# Altium project SG_Proto_PDB.PrjPcb
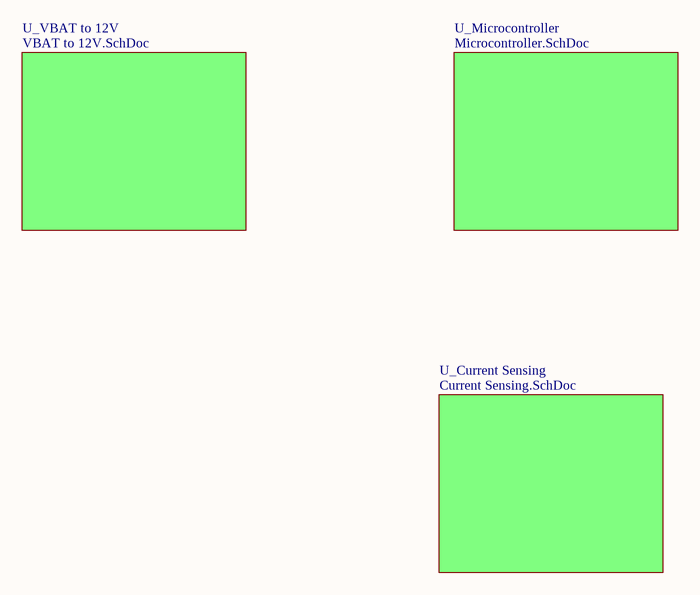
[diagram p0: Seaglider_Power_Board_Schematic.SchDoc]
4 sheets, 81 parts. Net scope: flat (ports and power ports of the same name join across sheets).
Board files: VBAT_to_12V.PcbDoc, Current_Sensor.PcbDoc, Microcontroller.PcbDoc
Sheets:
  Seaglider_Power_Board_Schematic.SchDoc
    U_VBAT to 12V = VBAT to 12V.SchDoc
    U_Microcontroller = Microcontroller.SchDoc
    U_Current Sensing = Current Sensing.SchDoc

## Sheet Seaglider_Power_Board_Schematic.SchDoc
size A; SheetNumber: 1; SheetTotal: 4

### Sub-sheets
U_Current Sensing = Current Sensing.SchDoc: no entries
U_Microcontroller = Microcontroller.SchDoc: no entries
U_VBAT to 12V = VBAT to 12V.SchDoc: no entries

## Sheet VBAT to 12V.SchDoc
size A; SheetNumber: 3; SheetTotal: 4
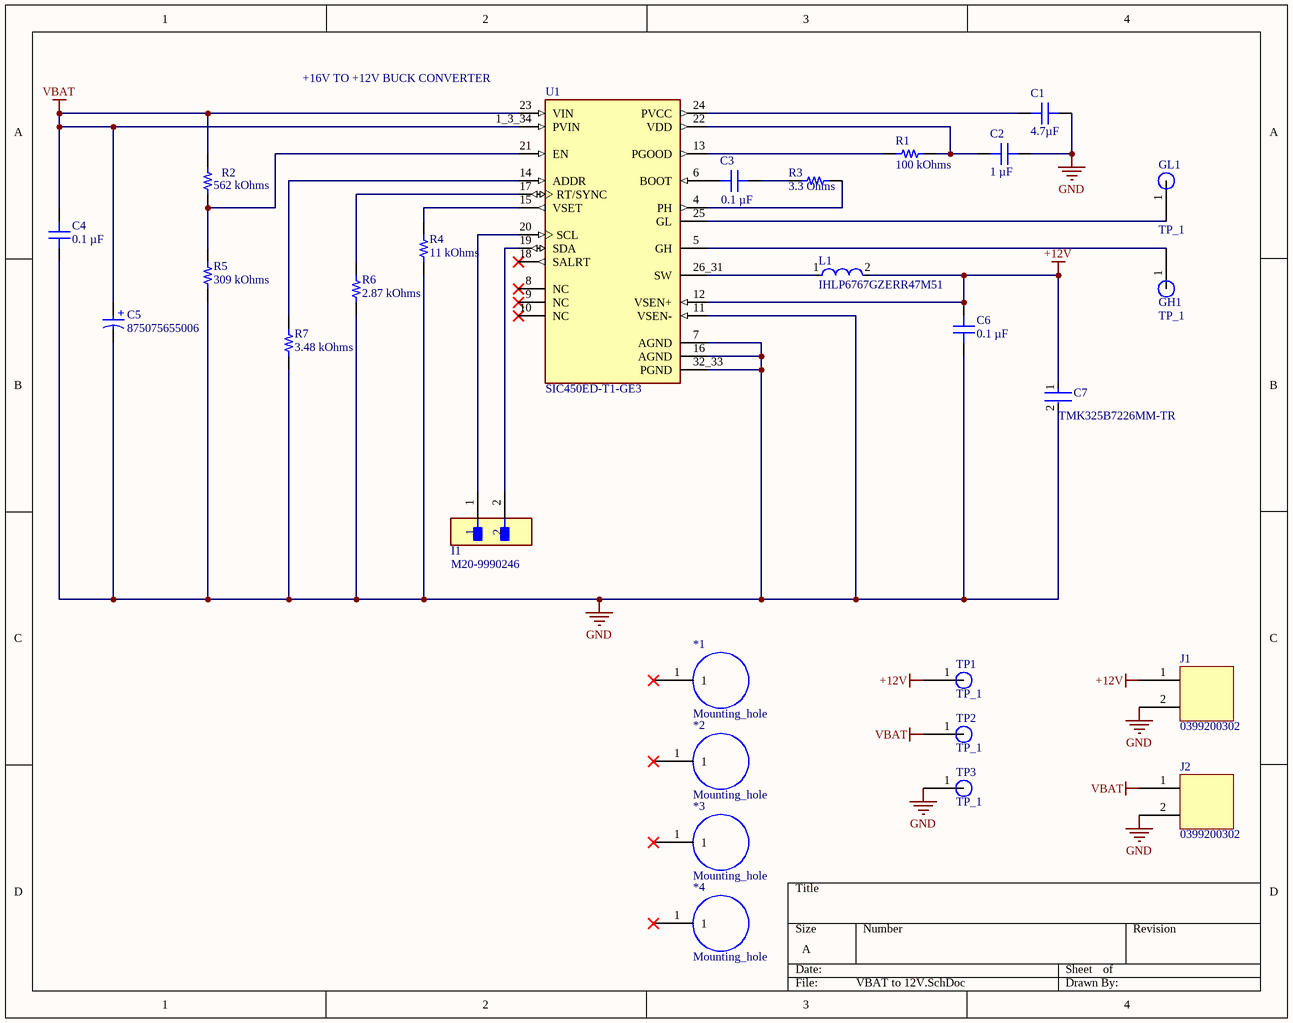
[diagram p1: VBAT to 12V.SchDoc]

### Parts
*1  Mounting_hole  [Mounting_Hole]
*2  Mounting_hole  [Mounting_Hole]
*3  Mounting_hole  [Mounting_Hole]
*4  Mounting_hole  [Mounting_Hole]
C1  4.7µF  [CAP 0603_1608]
C2  1 µF  [CAP 0603_1608]
C3  0.1 µF  [CAP 0402_1005]
C4  0.1 µF  [CAP 0402_1005]
C5  875075655006  [WCAP-PSLC_D8H11.7]
C6  0.1 µF  [CAP 0402_1005]
C7  TMK325B7226MM-TR  [FP-1210-L_3_2_0_3-W_2_5_0-MFG]
GH1  TP_1  [Test_point1]  (no BOM)
GL1  TP_1  [Test_point1]  (no BOM)
I1  M20-9990246  [FP-M20-9990246-MFG]
J1  0399200302  [0399200302]  (no BOM)
J2  0399200302  [0399200302]  (no BOM)
L1  IHLP6767GZERR47M51  [FP-IHLP-6767GZ-FP_3_825x1-MFG]
R1  100 kOhms  [RES 0402_1005]
R2  562 kOhms  [RES 0603_1608]
R3  3.3 Ohms  [RES 0402_1005]
R4  11 kOhms  [RES 0603_1608]
R5  309 kOhms  [RES 0603_1608]
R6  2.87 kOhms  [RES 0603_1608]
R7  3.48 kOhms  [RES 0603_1608]
TP1  TP_1  [Test_point1]  (no BOM)
TP2  TP_1  [Test_point1]  (no BOM)
TP3  TP_1  [Test_point1]  (no BOM)
U1  SIC450ED-T1-GE3  [VREG_SIC450ED-T1-GE3]

### Nets
+12V: C6.2 C7.1 J1.1 L1.2 TP1.1 U1.12(VSEN+)
GND: C1.1 C2.1 C4.1 C5.2(N) C6.1 C7.2 J1.2 J2.2 R4.1 R5.1 R6.1 R7.1 TP3.1 U1.7(AGND) U1.11(VSEN-) U1.16(AGND) U1.32_33(PGND)
VBAT: C4.2 C5.1(P) J2.1 R2.2 TP2.1 U1.1_3_34(PVIN) U1.23(VIN)
NetC1_2: C1.2 U1.24(PVCC)
NetC2_2: C2.2 R1.1 U1.22(VDD)
NetC3_1: C3.1 U1.6(BOOT)
NetC3_2: C3.2 R3.1
NetGH1_1: GH1.1 U1.5(GH)
NetGL1_1: GL1.1 U1.25(GL)
NetI1_1: I1.1 U1.20(SCL)
NetI1_2: I1.2 U1.19(SDA)
NetL1_1: L1.1 U1.26_31(SW)
NetR1_2: R1.2 U1.13(PGOOD)
NetR2_1: R2.1 R5.2 U1.21(EN)
NetR3_2: R3.2 U1.4(PH)
NetR4_2: R4.2 U1.15(VSET)
NetR6_2: R6.2 U1.17(RT/SYNC)
NetR7_2: R7.2 U1.14(ADDR)

Not connected (* = marked no-connect by the designer): *1 1*; *2 1*; *3 1*; *4 1*; U1 8(NC)* 9(NC)* 10(NC)* 18(SALRT)*

### Notes on the sheet
- +16V TO +12V BUCK CONVERTER
- (in symbol CMP-03913-90235614-1) +

### Library data of the parts
C1 = 06036D475KAT4A: CAP CER 4.7UF 6.3V X5R 0603; manufacturer: AVX Corporation; Tolerance: ±10%; Part Number: 06036D475KAT4A; Value: 4.7µF; Applications: General Purpose; Capacitance: 4.7µF; componentlink1description: Datasheet; componentlink1url: http://datasheets.avx.com/cx5r.pdf; componentlink2description: DigiKey Link; componentlink2url: http://digikey.com/product-detail/en/avx-corporation/06036D475KAT4A/478-10813-1-ND/7536337; Device Package: 0603 (1608 Metric); lastupdated: 2020-09-02 1:03:34 AM; Lifecycle Status: Active; Minimum Order: 1; Mounting Type: Surface Mount, MLCC; Operating Temperature: -55°C ~ 85°C; Package / Case: 0603 (1608 Metric); packaging: TapeAndReel; partid: 2929; Part Status: Active; price: 0.02; series: -; Size / Dimension: 0.063" L x 0.032" W (1.60mm x 0.81mm); Supplier 1: DigiKey; Supplier Part Number 1: 478-10813-1-ND; Temperature Coefficient: X5R; Thickness (Max): 0.037" (0.94mm); Voltage - Rated: 6.3V
C2 = C0603X105M9RACAUTO: CAP CER 1UF 6.3V X7R 0603; manufacturer: KEMET; Tolerance: ±20%; Part Number: C0603X105M9RACAUTO; Value: 1 µF; Applications: Automotive, Boardflex Sensitive; Capacitance: 1 µF; componentlink1description: Datasheet; componentlink1url: https://api.kemet.com/component-edge/download/datasheet/C0603X105M9RACAUTO.pdf; componentlink2description: DigiKey Link; componentlink2url: https://www.digikey.com/en/products/detail/kemet/C0603X105M9RACAUTO/8635848; Device Package: 0603 (1608 Metric); Features: Soft Termination; lastupdated: 2024-01-28 8:09:58 PM; Lifecycle Status: Active; Minimum Order: 1; Mounting Type: Surface Mount, MLCC; Operating Temperature: -55°C ~ 125°C; Package / Case: 0603 (1608 Metric); packaging: TapeAndReel; partid: 2401; Part Status: Active; price: 0.06; Ratings: AEC-Q200; series: SMD Auto X7R Flex; Size / Dimension: 0.063" L x 0.031" W (1.60mm x 0.80mm); Supplier 1: DigiKey; Supplier Part Number 1: 399-17721-1-ND; Temperature Coefficient: X7R; Thickness (Max): 0.037" (0.95mm); Voltage - Rated: 6.3V
C3 = CL05B104KP5VPNC: CAP CER 100NF 10V X7R 0402; manufacturer: Samsung Electro-Mechanics; Tolerance: ±10%; Part Number: CL05B104KP5VPNC; Value: 0.1 µF; Applications: Automotive; Capacitance: 0.1 µF; componentlink1description: Datasheet; componentlink1url: https://mm.digikey.com/Volume0/opasdata/d220001/medias/docus/5458/CL05B104KP5VPNC_Spec.pdf; componentlink2description: DigiKey Link; componentlink2url: https://www.digikey.com/en/products/detail/samsung-electro-mechanics/CL05B104KP5VPNC/20498482; Device Package: 0402 (1005 Metric); lastupdated: 2024-01-28 8:02:59 PM; Lifecycle Status: Active; Minimum Order: 1; Mounting Type: Surface Mount, MLCC; Operating Temperature: -55°C ~ 125°C; Package / Case: 0402 (1005 Metric); packaging: TapeAndReel; partid: 56690; price: 0.01; Ratings: AEC-Q200; series: CL; Size / Dimension: 0.039" L x 0.020" W (1.00mm x 0.50mm); Supplier 1: DigiKey; Supplier Part Number 1: 1276-CL05B104KP5VPNCCT-ND; Temperature Coefficient: X7R; Thickness (Max): 0.022" (0.55mm); Voltage - Rated: 10V
C4 C6 = GCM155R71E104KE02D: CAP CER 0.1UF 25V X7R 0402; manufacturer: Murata Electronics; Tolerance: ±10%; Part Number: GCM155R71E104KE02D; Value: 0.1 µF; Applications: Automotive; Capacitance: 0.1 µF; componentlink1description: Datasheet; componentlink1url: https://search.murata.co.jp/Ceramy/image/img/A01X/G101/ENG/GCM155R71E104KE02-01.pdf; componentlink2description: DigiKey Link; componentlink2url: https://www.digikey.com/en/products/detail/murata-electronics/GCM155R71E104KE02D/7363175; Device Package: 0402 (1005 Metric); Lifecycle Status: Active; Minimum Order: 1; Mounting Type: Surface Mount, MLCC; Operating Temperature: -55°C ~ 125°C; Package / Case: 0402 (1005 Metric); packaging: TapeAndReel; partid: 2051; Part Status: Active; price: 0.01; Ratings: AEC-Q200; series: GCM; Size / Dimension: 0.039" L x 0.020" W (1.00mm x 0.50mm); Supplier 1: DigiKey; Supplier Part Number 1: 490-16431-1-ND; Temperature Coefficient: X7R; Thickness (Max): 0.022" (0.55mm); Voltage - Rated: 25V
  C4: lastupdated: 2024-02-09 8:04:37 PM
  C6: lastupdated: 2024-01-28 8:04:19 PM
C5 = CMP-03913-90235614-1: 875075655006 Cap, 150Uf, 35V, Alu Elec Smd, Polymer Rohs Compliant: Yes; Leakage Current: 840µA; ESR (Equivalent Series Resistance): 25mΩ; Capacitance: 150µF; Ripple Current: 3.8A; Width: 8.3mm; Min Operating Temperature: -55°C; Voltage Rating: 35V; Diameter: 8mm; Length: 11.7mm; RoHS: Compliant; NexarPartId: 90235614; Max Operating Temperature: 105°C
C7 = CMP-14477-000122-1: CAP CER 22UF 25V X7R 1210; Tolerance: 20%; Length: 3.2mm; Packaging: Tape and Reel; REACH SVHC: No SVHC; Case Code (Imperial): 1210; Mount: Surface Mount; Depth: 2.5mm; Resistor Type: Ceramic; Thickness: 0.106inch; Lead Free: Lead Free; Construction: Flat; Min Operating Temperature: -55°C; Voltage: 25V; Voltage Rating: 25V; Capacitance: 22uF; Radiation Hardening: No; Halogen Free: Halogen Free; Max Operating Temperature: 125°C; Case/Package: 1210; Case Code (Metric): 3225; Height: 2.5mm; Width: 0.098inch; Series: M; Package Quantity: 500; RoHS Compliant: Yes; Dielectric: X7R; Termination: SMD/SMT; Number of Pins: 2; Voltage Rating (DC): 25V
GH1 GL1 TP1-TP3 = Test_point1
I1 = CMP-15831-000009-1: CONN HEADER VERT 2POS 2.54MM; Manufacturer: Harwin; Conn Gender: Male; Conn Orientation: Vertical; Number Of Contacts: 2; Current Rating: 3A; ComponentLink2URL: https://cdn.harwin.com/pdfs/M20-999.pdf; ComponentLink2Description: Datasheet; Package: M20-9990246; Temperature: -40°C to +105°C; Octopart: https://octopart.com/m20-9990246-harwin-2590635; Mouser Description: 2.54mm (0.1") Pitch SIL Vertical PC Tail Pin Header, 6.1mm mating pin height, tin, 2 contacts; Temperature Range High: +105°C; Device Class L1: Connectors; RoHS: TRUE; Automotive: No; Height: 8.99mm; Number Of Rows: 1; Contact Material: Tin,Nickel; Category: Conn; Pitch: 2.54mm; Lead Free: Yes; Digikey Description: CONN HEADER VERT 2POS 2.54MM; Manufacturer Part Number: M20-9990246; Temperature Range Low: -40°C; Device Class L3: unset; Device Class L2: Headers and Wire Housings
L1 = CMP-02424-000445-1: Commercial Inductors, High Temperature (155 °C) Series 0.47uH 65A 0.95mΩ 20%; Max DC Current: 63A; DC Resistance (DCR): 0.95mR; Saturation Current: 76A; Resistance: 950R; Self Resonant Frequency: 52.3MHz; Inductance: 470nH; Test Frequency: 100kHz; Shielding: Shielded; Max Operating Temperature: 155°C; Height: 7mm; Case/Package: 6767; Termination: SMD/SMT; Width: 17.15mm; Package Quantity: 200; Length: 0.675inch; Tolerance: 20%; Inductance Tolerance: 20%; Depth: 17.5mm; Radiation Hardening: No; Height - Seated (Max): 0.276inch; RMS Current (Irms): 63A; Mount: Surface Mount; Current Rating: 65A; Lead Free: Lead Free; Weight: 0.417996oz; Packaging: Tape and Reel; Min Operating Temperature: -55°C
R1 = RT0402FRE07100KL: RES SMD 100K OHM 1% 1/16W 0402; Manufacturer: Yageo; Power (Watts): 0.063W, 1/16W; Temperature Coefficient: ±50ppm/°C; Part Number: RT0402FRE07100KL; Value: 100 kOhms; ComponentLink1Description: Datasheet; ComponentLink1URL: https://www.yageo.com/upload/media/product/productsearch/datasheet/rchip/PYu-RT_1-to-0.01_RoHS_L_11.pdf; ComponentLink2Description: DigiKey Link; ComponentLink2URL: https://www.digikey.com/en/products/detail/yageo/RT0402FRE07100KL/1071698; Composition: Thin Film; Device Package: 0402 (1005 Metric); Height - Seated (Max): 0.014" (0.35mm); LastUpdated: 2024-01-28 8:28:38 PM; Lifecycle Status: Active; Minimum Order: 1; Number of Terminations: 2; Operating Temperature: -55°C ~ 155°C; Package / Case: 0402 (1005 Metric); Packaging: TapeAndReel; PartId: 3190; Part Status: Active; Price: 0.01; Resistance: 100 kOhms; Series: RT; Size / Dimension: 0.039" L x 0.020" W (1.00mm x 0.50mm); Supplier 1: DigiKey; Supplier Part Number 1: YAG2307CT-ND; Supplier Device Package: 0402; Tolerance: ±1%
R2 = RK73H1JTTD5623F: RES 562K OHM 1% 1/10W 0603; Manufacturer: KOA Speer Electronics, Inc.; Power (Watts): 0.1W, 1/10W; Temperature Coefficient: ±100ppm/°C; Part Number: RK73H1JTTD5623F; Value: 562 kOhms; ComponentLink1Description: Datasheet; ComponentLink1URL: http://www.koaspeer.com/catimages/Products/RK73H/RK73H.pdf; ComponentLink2Description: DigiKey Link; ComponentLink2URL: https://www.digikey.com/en/products/detail/koa-speer-electronics-inc/RK73H1JTTD5623F/9845175; Composition: Thick Film; Device Package: 0603 (1608 Metric); Features: Automotive AEC-Q200, Moisture Resistant; Height - Seated (Max): 0.022" (0.55mm); LastUpdated: 2024-01-28 8:39:45 PM; Lifecycle Status: Active; Minimum Order: 1; Number of Terminations: 2; Operating Temperature: -55°C ~ 155°C; Package / Case: 0603 (1608 Metric); Packaging: CutTape; PartId: 8595; Part Status: Active; Price: 0.01; Ratings: AEC-Q200; Resistance: 562 kOhms; Series: RK73H; Size / Dimension: 0.063" L x 0.031" W (1.60mm x 0.80mm); Supplier 1: DigiKey; Supplier Part Number 1: 2019-RK73H1JTTD5623FCT-ND; Supplier Device Package: 0603; Tolerance: ±1%
R3 = ERJ-2GEJ3R3X: RES SMD 3.3 OHM 5% 1/10W 0402; Manufacturer: Panasonic Electronic Components; Power (Watts): 0.1W, 1/10W; Temperature Coefficient: -100/ +600ppm/°C; Part Number: ERJ-2GEJ3R3X; Value: 3.3 Ohms; ComponentLink1Description: Datasheet; ComponentLink1URL: https://b2b-api.panasonic.eu/file_stream/pids/fileversion/1242; ComponentLink2Description: DigiKey Link; ComponentLink2URL: https://www.digikey.com/en/products/detail/panasonic-electronic-components/ERJ-2GEJ3R3X/282082; Composition: Thick Film; Device Package: 0402 (1005 Metric); Features: Automotive AEC-Q200; Height - Seated (Max): 0.016" (0.40mm); LastUpdated: 2024-01-28 8:28:37 PM; Lifecycle Status: Active; Minimum Order: 1; Number of Terminations: 2; Operating Temperature: -55°C ~ 155°C; Package / Case: 0402 (1005 Metric); Packaging: CutTape; PartId: 3568; Part Status: Active; Price: 0.01; Ratings: AEC-Q200; Resistance: 3.3 Ohms; Series: ERJ-2G; Size / Dimension: 0.039" L x 0.020" W (1.00mm x 0.50mm); Supplier 1: DigiKey; Supplier Part Number 1: P3.3JCT-ND; Supplier Device Package: 0402; Tolerance: ±5%
R4 = TNPW060311K0BYEN: RES 11K OHM 0.1% 1/10W 0603; Manufacturer: Vishay Dale; Power (Watts): 0.1W, 1/10W; Temperature Coefficient: ±10ppm/°C; Part Number: TNPW060311K0BYEN; Value: 11 kOhms; ComponentLink1Description: Datasheet; ComponentLink1URL: http://www.vishay.com/docs/28758/tnpw_e3.pdf; ComponentLink2Description: DigiKey Link; ComponentLink2URL: https://www.digikey.com/en/products/detail/vishay-dale/TNPW060311K0BYEN/8636632; Composition: Thin Film; Device Package: 0603 (1608 Metric); Features: Anti-Sulfur, Automotive AEC-Q200, Moisture Resistant; Height - Seated (Max): 0.022" (0.55mm); LastUpdated: 2024-01-28 8:39:55 PM; Lifecycle Status: Active; Minimum Order: 1; Number of Terminations: 2; Operating Temperature: -55°C ~ 155°C; Package / Case: 0603 (1608 Metric); Packaging: TapeAndReel; PartId: 6393; Part Status: Active; Price: 0.25; Ratings: AEC-Q200; Resistance: 11 kOhms; Series: TNPW e3; Size / Dimension: 0.061" L x 0.033" W (1.55mm x 0.85mm); Supplier 1: DigiKey; Supplier Part Number 1: 541-9816-1-ND; Supplier Device Package: 0603; Tolerance: ±0.1%
R5 = RG1608P-3093-B-T5: RES SMD 309K OHM 0.1% 1/10W 0603; Manufacturer: Susumu; Power (Watts): 0.1W, 1/10W; Temperature Coefficient: ±25ppm/°C; Part Number: RG1608P-3093-B-T5; Value: 309 kOhms; ComponentLink1Description: Datasheet; ComponentLink1URL: //media.digikey.com/pdf/Data%20Sheets/Susumu%20PDFs/RG_RM_RGH_Oct2012.pdf; ComponentLink2Description: DigiKey Link; ComponentLink2URL: https://www.digikey.com/en/products/detail/susumu/RG1608P-3093-B-T5/1240553; Composition: Thin Film; Device Package: 0603 (1608 Metric); Features: Anti-Sulfur, Automotive AEC-Q200; Height - Seated (Max): 0.020" (0.50mm); LastUpdated: 2024-01-28 8:39:51 PM; Lifecycle Status: Active; Minimum Order: 1; Number of Terminations: 2; Operating Temperature: -55°C ~ 155°C; Package / Case: 0603 (1608 Metric); Packaging: TapeAndReel; PartId: 7313; Part Status: Active; Price: 0.05; Ratings: AEC-Q200; Resistance: 309 kOhms; Series: RG; Size / Dimension: 0.063" L x 0.031" W (1.60mm x 0.80mm); Supplier 1: DigiKey; Supplier Part Number 1: RG16P309KBCT-ND; Supplier Device Package: 0603; Tolerance: ±0.1%
R6 = RC0603FR-072K87L: RES 2.87K OHM 1% 1/10W 0603; Manufacturer: Yageo; Power (Watts): 0.1W, 1/10W; Temperature Coefficient: ±100ppm/°C; Part Number: RC0603FR-072K87L; Value: 2.87 kOhms; ComponentLink1Description: Datasheet; ComponentLink1URL: https://www.yageo.com/upload/media/product/productsearch/datasheet/rchip/PYu-RC_Group_51_RoHS_L_10.pdf; ComponentLink2Description: DigiKey Link; ComponentLink2URL: https://www.digikey.com/en/products/detail/yageo/RC0603FR-072K87L/727036; Composition: Thick Film; Device Package: 0603 (1608 Metric); Features: Moisture Resistant; Height - Seated (Max): 0.022" (0.55mm); LastUpdated: 2024-01-28 8:39:50 PM; Lifecycle Status: Active; Minimum Order: 1; Number of Terminations: 2; Operating Temperature: -55°C ~ 155°C; Package / Case: 0603 (1608 Metric); Packaging: CutTape; PartId: 7498; Part Status: Active; Price: 0.01; Resistance: 2.87 kOhms; Series: RC_L; Size / Dimension: 0.063" L x 0.031" W (1.60mm x 0.80mm); Supplier 1: DigiKey; Supplier Part Number 1: 311-2.87KHRCT-ND; Supplier Device Package: 0603; Tolerance: ±1%
R7 = RNCP0603FTD3K48: RES 3.48K OHM 1% 1/8W 0603; Manufacturer: Stackpole Electronics Inc; Power (Watts): 0.125W, 1/8W; Temperature Coefficient: ±100ppm/°C; Part Number: RNCP0603FTD3K48; Value: 3.48 kOhms; ComponentLink1Description: Datasheet; ComponentLink1URL: https://www.seielect.com/catalog/sei-rncp.pdf; ComponentLink2Description: DigiKey Link; ComponentLink2URL: https://www.digikey.com/en/products/detail/stackpole-electronics-inc/RNCP0603FTD3K48/2240122; Composition: Thin Film; Device Package: 0603 (1608 Metric); Features: Anti-Sulfur; Height - Seated (Max): 0.020" (0.50mm); LastUpdated: 2024-01-28 8:39:52 PM; Lifecycle Status: Active; Minimum Order: 1; Number of Terminations: 2; Operating Temperature: -55°C ~ 155°C; Package / Case: 0603 (1608 Metric); Packaging: TapeAndReel; PartId: 6983; Part Status: Active; Price: 0.01; Resistance: 3.48 kOhms; Series: RNCP; Size / Dimension: 0.059" L x 0.031" W (1.50mm x 0.80mm); Supplier 1: DigiKey; Supplier Part Number 1: RNCP0603FTD3K48CT-ND; Supplier Device Package: 0603; Tolerance: ±1%
U1 = CMP-351-000000-4: Buck Switching Regulator IC Positive Adjustable 0.3V 1 Output 40A 34-PowerWFQFN; MF: Vishay Siliconix; Design Item ID: SIC450ED-T1-GE3; Source: SIC450ED-T1-GE3.SchLib; MP: SIC450ED-T1-GE3; Availability: In Stock; Purchase-URL: https://pricing.snapeda.com/search/part/SIC450ED-T1-GE3/?ref=eda; Package: PowerWFQFN-34 Vishay Siliconix; Component Type: Standard; Pin Count: 25; Check_prices: https://www.snapeda.com/parts/SIC450ED-T1-GE3/Vishay+Siliconix/view-part/?ref=eda; SnapEDA_Link: https://www.snapeda.com/parts/SIC450ED-T1-GE3/Vishay+Siliconix/view-part/?ref=snap; Value: *; Price: None

## Sheet Microcontroller.SchDoc
size 558 x 431 mm; SheetNumber: 2; SheetTotal: 4
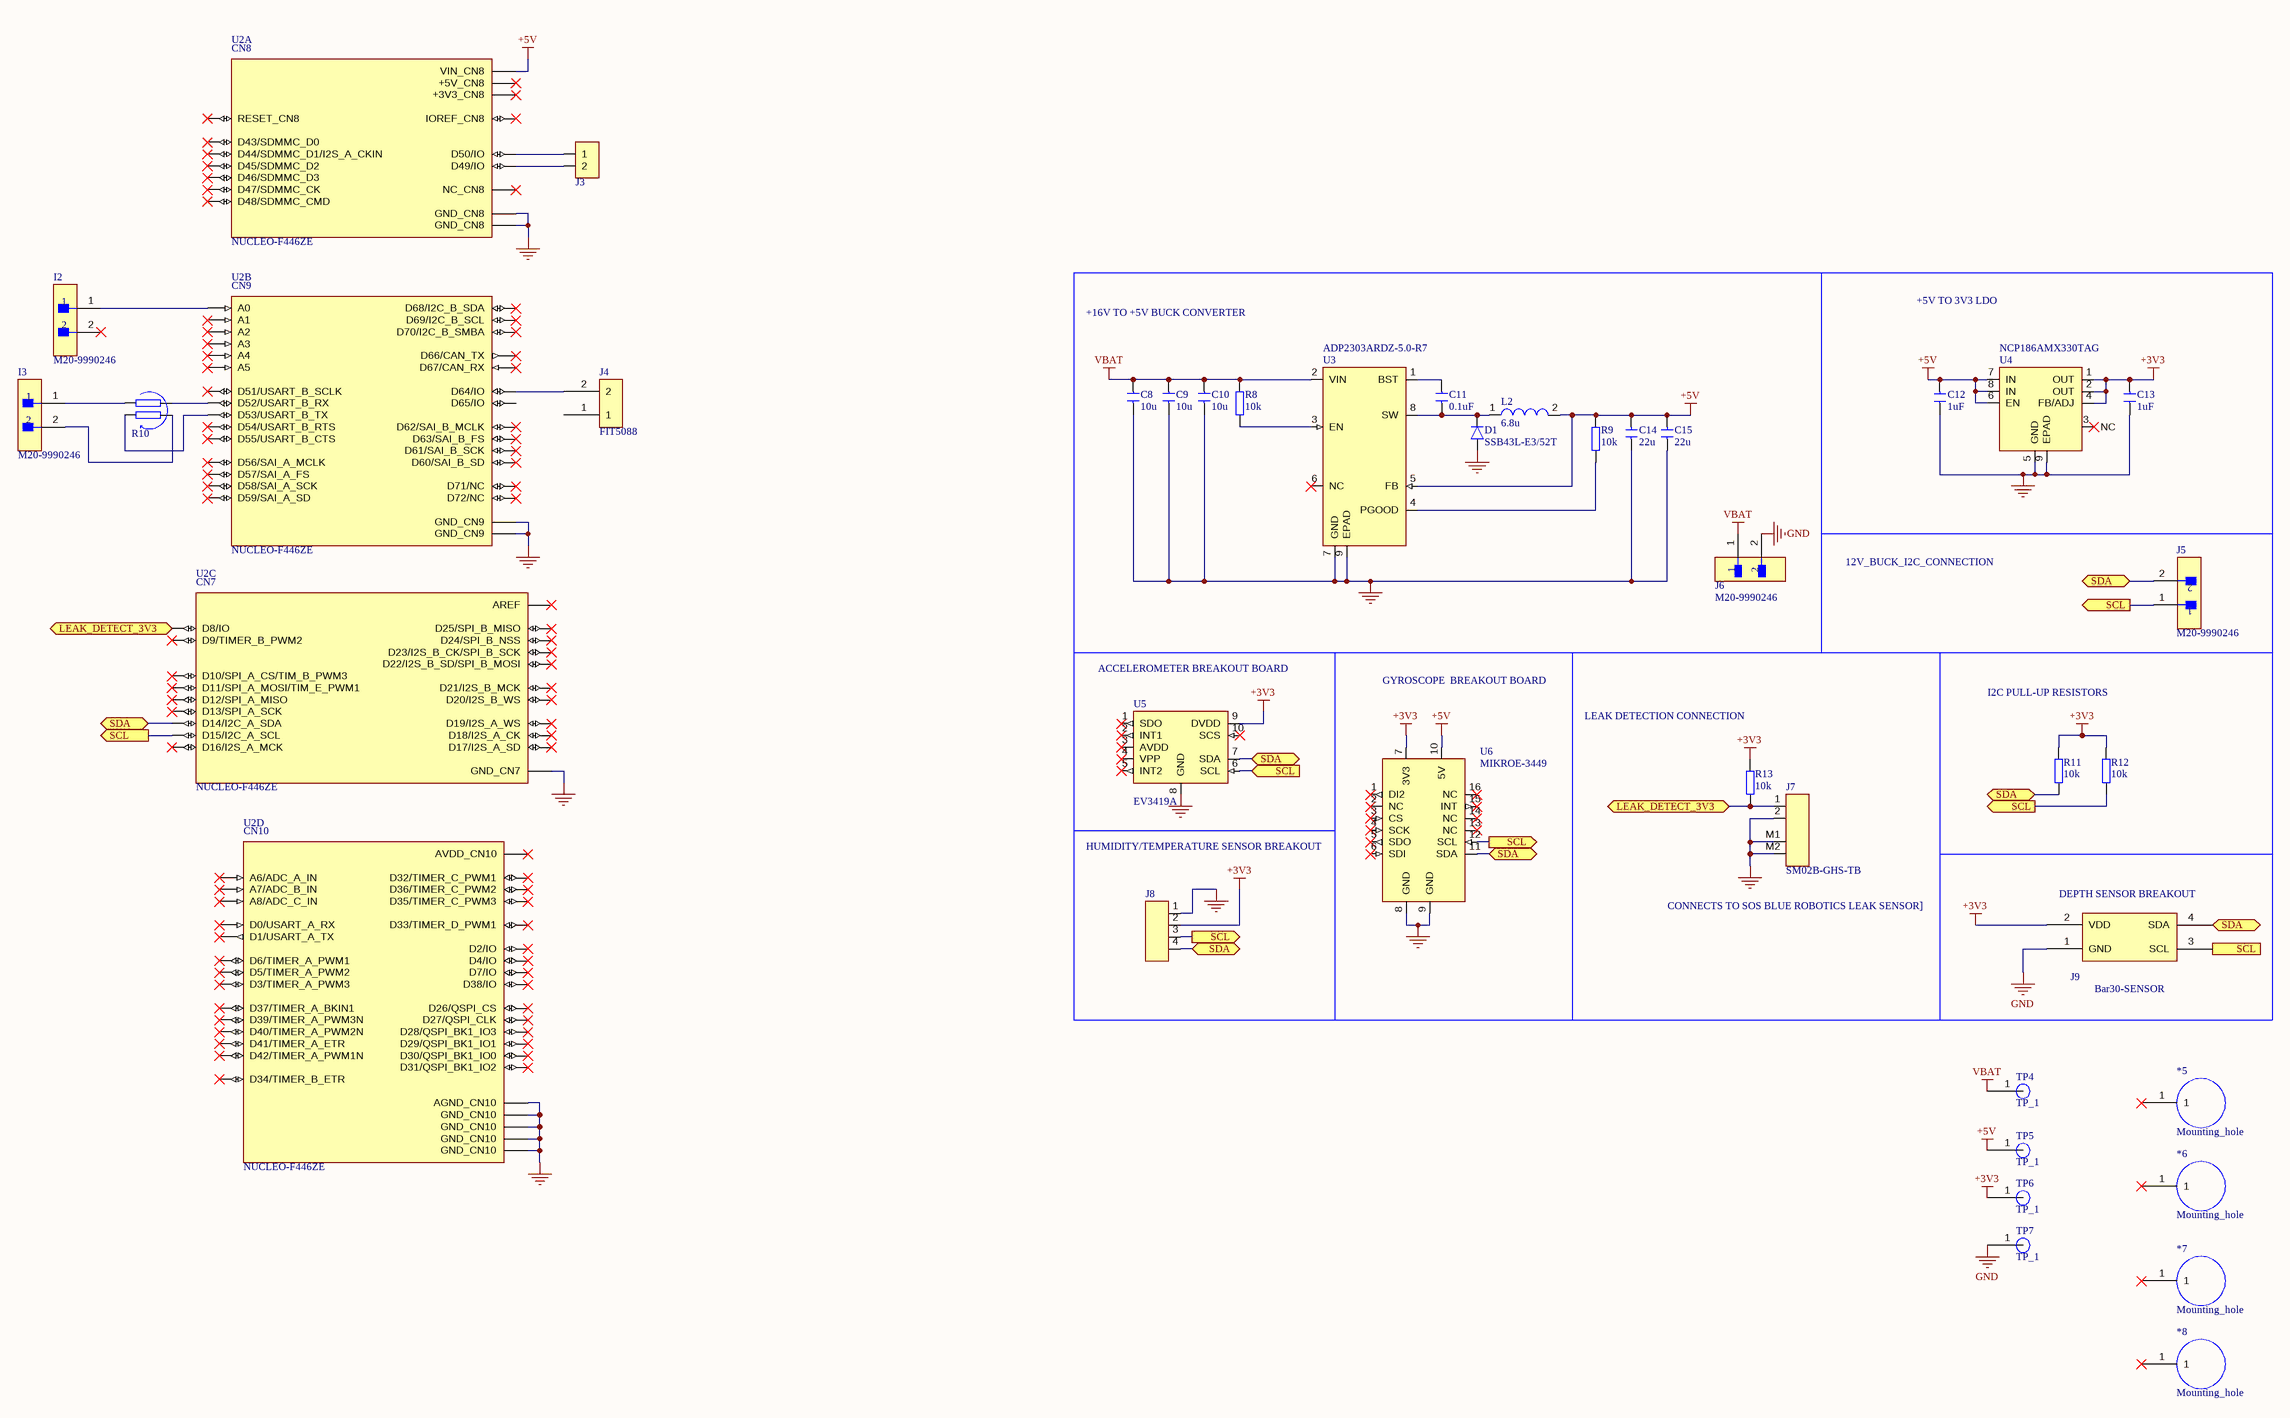
[diagram p2: Microcontroller.SchDoc]

### Parts
*5  Mounting_hole  [Mounting_Hole]
*6  Mounting_hole  [Mounting_Hole]
*7  Mounting_hole  [Mounting_Hole]
*8  Mounting_hole  [Mounting_Hole]
C8  10u  [1206 Capacitor]
C9  10u  [1206 Capacitor]
C10  10u  [1206 Capacitor]
C11  0.1uF  [0603 Capacitor]
C12  1uF  [0603 Capacitor]
C13  1uF  [0603 Capacitor]
C14  22u  [0805 Capacitor]
C15  22u  [0805 Capacitor]
D1  SSB43L-E3/52T  [DO-214AA]
I2  M20-9990246  [FP-M20-9990246-MFG]
I3  M20-9990246  [FP-M20-9990246-MFG]
J3  PREC002SAAN-RC  [Header 2.54mm]  (value not drawn)
J4  FIT5088  [FIT0588]
J5  M20-9990246  [FP-M20-9990246-MFG]
J6  M20-9990246  [FP-M20-9990246-MFG]
J7  SM02B-GHS-TB  [SM02B-GHS-TB]
J8  PPTC041LFBN-RC  [HDR 4POS 2.54mm]  (value not drawn)
J9  Bar30-SENSOR  [Bar30 Depth Sensor]
L2  6.8u  [CLF10060NIT-6R8N-D 10.10mm x 10.00mm]
R8  10k  [0603 Resistor]
R9  10k  [0603 Resistor]
R10  Resistor Signal Switch  [Resistor Signal Switch-Footprint]  (value not drawn)
R11  10k  [0603 Resistor]
R12  10k  [0603 Resistor]
R13  10k  [0603 Resistor]
TP4  TP_1  [Test_point1]  (no BOM)
TP5  TP_1  [Test_point1]  (no BOM)
TP6  TP_1  [Test_point1]  (no BOM)
TP7  TP_1  [Test_point1]  (no BOM)
U2  NUCLEO-F446ZE  [MODULE_NUCLEO-F446ZE]  (parts A,B,C,D of 4)
U3  ADP2303ARDZ-5.0-R7  [SOIC-8-EP]
U4  NCP186AMX330TAG  [8-XFDFN Exposed Pad]
U5  EV3419A  [EV3419A]
U6  MIKROE-3449  [MIKROE-3449]

### Ports
LEAK_DETECT_3V3 (bidir, see Microcontroller[3E]), LEAK_DETECT_3V3 (bidir, see Microcontroller[9E]), SCL (in, see Microcontroller[1D], Microcontroller[2E], Microcontroller[4D], Microcontroller[5D], Microcontroller[9E]), SCL (out, see Microcontroller[1D], Microcontroller[2E], Microcontroller[4D], Microcontroller[5D], Microcontroller[5E]), SCL (out, see Microcontroller[1D], Microcontroller[2E], Microcontroller[4D], Microcontroller[5D], Microcontroller[5E], Microcontroller[9E]), SCL (out, see Microcontroller[1D], Microcontroller[2E], Microcontroller[4D], Microcontroller[5E], Microcontroller[9E]), SCL (out, see Microcontroller[1D], Microcontroller[2E], Microcontroller[5D], Microcontroller[5E], Microcontroller[9E]), SCL (out, see Microcontroller[2E], Microcontroller[4D], Microcontroller[5D], Microcontroller[5E], Microcontroller[9E]), SDA (bidir, see Microcontroller[1D], Microcontroller[2E], Microcontroller[4D], Microcontroller[5D], Microcontroller[5E]), SDA (bidir, see Microcontroller[1D], Microcontroller[2E], Microcontroller[4D], Microcontroller[5D], Microcontroller[5E], Microcontroller[9E]), SDA (bidir, see Microcontroller[1D], Microcontroller[2E], Microcontroller[4D], Microcontroller[5D], Microcontroller[9E]), SDA (bidir, see Microcontroller[1D], Microcontroller[2E], Microcontroller[4D], Microcontroller[5E], Microcontroller[9E]), SDA (bidir, see Microcontroller[1D], Microcontroller[2E], Microcontroller[5D], Microcontroller[5E], Microcontroller[9E]), SDA (bidir, see Microcontroller[2E], Microcontroller[4D], Microcontroller[5D], Microcontroller[5E], Microcontroller[9E])

### Nets
+3V3: C13.1 J8.2 J9.2(VDD) R11.2 R12.2 R13.2 TP6.1 U4.1(OUT) U4.2(OUT) U4.4(FB/ADJ) U5.9(DVDD) U6.7(3V3)
+5V: C12.1 C14.1 C15.1 L2.2 R9.1 TP5.1 U2.CN8_15(VIN_CN8) U3.5(FB) U4.6(EN) U4.7(IN) U4.8(IN) U6.10(5V)
GND: C8.1 C9.1 C10.1 C12.2 C13.2 C14.2 C15.2 D1.A J6.2 J7.2 J7.M1 J7.M2 J8.1 J9.1(GND) TP7.1 U2.CN7_8(GND_CN7) U2.CN8_11(GND_CN8) U2.CN8_13(GND_CN8) U2.CN9_12(GND_CN9) U2.CN9_23(GND_CN9) U2.CN10_3(AGND_CN10) U2.CN10_5(GND_CN10) U2.CN10_17(GND_CN10) U2.CN10_22(GND_CN10) U2.CN10_27(GND_CN10) U3.7(GND) U3.9(EPAD) U4.5(GND) U4.9(EPAD) U5.8(GND) U6.8(GND) U6.9(GND)
VBAT: C8.2 C9.2 C10.2 J6.1 R8.1 TP4.1 U3.2(VIN)
NetC11_1: C11.1 D1.C L2.1 U3.8(SW)
NetC11_2: C11.2 U3.1(BST)
NetI2_1: I2.1 U2.CN9_1(A0)
NetI3_1: I3.1 R10.4
NetI3_2: I3.2 R10.1
NetJ3_1: J3.1 U2.CN8_16(D50/IO)
NetJ3_2: J3.2 U2.CN8_14(D49/IO)
NetJ4_2: J4.2 U2.CN9_30(D64/IO)
NetJ5_1: J5.1 J8.3 J9.3(SCL) R12.1 U2.CN7_2(D15/I2C_A_SCL) U5.6(SCL) U6.12(SCL) ; port SCL
NetJ5_2: J5.2 J8.4 J9.4(SDA) R11.1 U2.CN7_4(D14/I2C_A_SDA) U5.7(SDA) U6.11(SDA) ; port SDA
NetJ7_1: J7.1 R13.1 U2.CN7_20(D8/IO) ; port LEAK_DETECT_3V3
NetR8_2: R8.2 U3.3(EN)
NetR9_2: R9.2 U3.4(PGOOD)
NetR10_2: R10.2 U2.CN9_6(D53/USART_B_TX)
NetR10_3: R10.3 U2.CN9_4(D52/USART_B_RX)

Not connected (* = marked no-connect by the designer): *5 1*; *6 1*; *7 1*; *8 1*; I2 2*; J4 1; U2 CN7_1(D16/I2S_A_MCK)* CN7_3(D17/I2S_A_SD)* CN7_5(D18/I2S_A_CK)* CN7_6(AREF)* CN7_7(D19/I2S_A_WS)* CN7_9(D20/I2S_B_WS)* CN7_10(D13/SPI_A_SCK)* CN7_11(D21/I2S_B_MCK)* CN7_12(D12/SPI_A_MISO)* CN7_13(D22/I2S_B_SD/SPI_B_MOSI)* CN7_14(D11/SPI_A_MOSI/TIM_E_PWM1)* CN7_15(D23/I2S_B_CK/SPI_B_SCK)* CN7_16(D10/SPI_A_CS/TIM_B_PWM3)* CN7_17(D24/SPI_B_NSS)* CN7_18(D9/TIMER_B_PWM2)* CN7_19(D25/SPI_B_MISO)* CN8_1(NC_CN8)* CN8_2(D43/SDMMC_D0)* CN8_3(IOREF_CN8)* CN8_4(D44/SDMMC_D1/I2S_A_CKIN)* CN8_5(RESET_CN8)* CN8_6(D45/SDMMC_D2)* CN8_7(+3V3_CN8)* CN8_8(D46/SDMMC_D3)* CN8_9(+5V_CN8)* CN8_10(D47/SDMMC_CK)* CN8_12(D48/SDMMC_CMD)* CN9_2(D51/USART_B_SCLK)* CN9_3(A1)* CN9_5(A2)* CN9_7(A3)* CN9_8(D54/USART_B_RTS)* CN9_9(A4)* CN9_10(D55/USART_B_CTS)* CN9_11(A5)* CN9_13(D72/NC)* CN9_14(D56/SAI_A_MCLK)* CN9_15(D71/NC)* CN9_16(D57/SAI_A_FS)* CN9_17(D70/I2C_B_SMBA)* CN9_18(D58/SAI_A_SCK)* CN9_19(D69/I2C_B_SCL)* CN9_20(D59/SAI_A_SD)* CN9_21(D68/I2C_B_SDA)* CN9_22(D60/SAI_B_SD)* CN9_24(D61/SAI_B_SCK)* CN9_25(D67/CAN_RX)* CN9_26(D62/SAI_B_MCLK)* CN9_27(D66/CAN_TX)* CN9_28(D63/SAI_B_FS)* CN9_29(D65/IO) CN10_1(AVDD_CN10)* CN10_2(D7/IO)* CN10_4(D6/TIMER_A_PWM1)* CN10_6(D5/TIMER_A_PWM2)* CN10_7(A6/ADC_A_IN)* CN10_8(D4/IO)* CN10_9(A7/ADC_B_IN)* CN10_10(D3/TIMER_A_PWM3)* CN10_11(A8/ADC_C_IN)* CN10_12(D2/IO)* CN10_13(D26/QSPI_CS)* CN10_14(D1/USART_A_TX)* CN10_15(D27/QSPI_CLK)* CN10_16(D0/USART_A_RX)* CN10_18(D42/TIMER_A_PWM1N)* CN10_19(D28/QSPI_BK1_IO3)* CN10_20(D41/TIMER_A_ETR)* CN10_21(D29/QSPI_BK1_IO1)* CN10_23(D30/QSPI_BK1_IO0)* CN10_24(D40/TIMER_A_PWM2N)* CN10_25(D31/QSPI_BK1_IO2)* CN10_26(D39/TIMER_A_PWM3N)* CN10_28(D38/IO)* CN10_29(D32/TIMER_C_PWM1)* CN10_30(D37/TIMER_A_BKIN1)* CN10_31(D33/TIMER_D_PWM1)* CN10_32(D36/TIMER_C_PWM2)* CN10_33(D34/TIMER_B_ETR)* CN10_34(D35/TIMER_C_PWM3)*; U3 6(NC)*; U4 3(NC); U5 1(SDO)* 2(INT1)* 3(AVDD)* 4(VPP)* 5(INT2)* 10(SCS)*; U6 1(DI2)* 2(NC)* 3(CS)* 4(SCK)* 5(SDO)* 6(SDI)* 13(NC)* 14(NC)* 15(INT)* 16(NC)*

### Notes on the sheet
- +16V TO +5V BUCK CONVERTER
- +5V TO 3V3 LDO
- 12V_BUCK_I2C_CONNECTION
- ACCELEROMETER BREAKOUT BOARD
- GYROSCOPE  BREAKOUT BOARD
- LEAK DETECTION CONNECTION
- I2C PULL-UP RESISTORS
- HUMIDITY/TEMPERATURE SENSOR BREAKOUT
- CONNECTS TO SOS BLUE ROBOTICS LEAK SENSOR]
- (near J9) DEPTH SENSOR BREAKOUT
- DWG. NO.
- REV.
- SHT.
- REVISION
- DESCRIPTION
- DATE
- APPROVED
- THIS DOCUMENT AND THE DATA DISCLOSED HEREIN OR HEREWITH IS THE PROPERTY OF ALTIUM LIMITED AND MAY BE FREELY DISTRIBUTED IN WHOLE. NO RIGHTS ARE RESERVED OR EXPRESS OR IMPLIED WARANTEE GIVEN.
- ENG:
- DSN:
- APPROVALS
- PROJECT
- DOCUMENT REVISION:
- DESIGN ITEM:
- CHK:
- BOM:
- REFERENCE DOCUMENTS
- PROJECT REVISION:
- TITLE
- FAB DWG:
- PCB DWG:
- ASSY DWG:
- SCALE:
- SIZE
- C
- CAGE CODE
- FILE NAME
- DWG NO.
- SHEET
- OF
- REV
- (in symbol CMP-357-000000-6, part A) CN8
- (in symbol CMP-357-000000-6, part B) CN9
- (in symbol CMP-357-000000-6, part C) CN7
- (in symbol CMP-357-000000-6, part D) CN10

### Library data of the parts
C8-C10 = GRM31CR71E106MA12L: CAP CER 10UF 25V X7R 1206; Manufacturer: Murata; Material: 4241ConductorMaterial; Tolerance: 20%; Supplier: Digi-Key; Supplier Part Number: 490-6519-1-ND; Manufacturer Part Number: GRM31CR71E106MA12L; RoHS: Yes; Category: Ceramic Capacitors; Stock: 74067; Pricing: 1=0.29, 10=0.199, 50=0.1396, 100=0.1196, 500=0.08972, 1000=0.07576 (USD); Mounting Technology: Surface Mount; Case/Package: 1206; Case Code (Metric): 3216; Case Code (Imperial): 1206; Min Operating Temperature: -55°C; Max Operating Temperature: 125°C; Value: 10uF; Dielectric: X7R; Package Quantity: 1; Voltage Rating: 25V; Packaging: Tape and Reel; Termination: SMD/SMT; Voltage: 25V; Voltage Rating (DC): 25V; Series: GRM; Construction: Flat; Length: 3.2mm; Width: 0.063inch; Height: 1.6mm; Thickness: 0.071inch; Depth: 1.6mm; Radiation Hardening: No; Reach SVHC Compliant: No; Lead Free: Lead Free; RoHS Compliant: Yes; ComponentLink1URL: https://datasheet.ciiva.com/11607/product-11607561.pdf?src-supplier=Avnet; ComponentLink1Description: https://datasheet.ciiva.com/11607/product-11607561.pdf?src-supplier=Avnet; ComponentLink2URL: https://datasheet.ciiva.com/5412/product-5412861.pdf?src-supplier=Mouser; ComponentLink2Description: https://datasheet.ciiva.com/5412/product-5412861.pdf?src-supplier=Mouser; ComponentLink3URL: https://datasheet.ciiva.com/6264/partnumbering-e-01-6264463.pdf?src-supplier=Digi-Key; ComponentLink3Description: https://datasheet.ciiva.com/6264/partnumbering-e-01-6264463.pdf?src-supplier=Digi-Key
C11 = CC0603KRX7R9BB104: CAP CER 0.1UF 50V X7R 0603; Manufacturer: Yageo; Dielectric Material: Ceramic; Value: 100nF; Tolerance: 10%; Supplier: Digi-Key; Supplier Part Number: 311-1344-1-ND; Manufacturer Part Number: CC0603KRX7R9BB104; RoHS: Yes; Category: Ceramic Capacitors; Stock: 4893723; Pricing: 1=0.1, 10=0.054, 50=0.0296, 100=0.0243, 500=0.01732, 1000=0.01361 (USD); Mounting Technology: Surface Mount; Case/Package: 0603; Pins: 2; Case Code (Metric): 1608; Case Code (Imperial): 0603; Min Operating Temperature: -55°C; Max Operating Temperature: 125°C; Package Quantity: 1; Voltage Rating: 50V; Packaging: Tape and Reel; Dielectric: X7R; Termination: SMD/SMT; Voltage: 50V; Series: CC; Length: 0.063inch; Width: 0.031inch; Height: 0.8mm; Thickness: 0.035inch; Depth: 0.8mm; Radiation Hardening: No; Reach SVHC Compliant: No; Lead Free: Lead Free; Halogen Free: Halogen Free; RoHS Compliant: Yes; ComponentLink1URL: https://datasheet.ciiva.com/11786/0900766b80d84f1d-11786061.pdf?src-supplier=Rs; ComponentLink1Description: https://datasheet.ciiva.com/11786/0900766b80d84f1d-11786061.pdf?src-supplier=Rs; ComponentLink2URL: https://datasheet.ciiva.com/8033/70765-8033819.pdf?src-supplier=Element14; ComponentLink2Description: https://datasheet.ciiva.com/8033/70765-8033819.pdf?src-supplier=Element14; ComponentLink3URL: https://datasheet.ciiva.com/8033/70765-8033821.pdf?src-supplier=Element14; ComponentLink3Description: https://datasheet.ciiva.com/8033/70765-8033821.pdf?src-supplier=Element14; ComponentLink4URL: https://datasheet.ciiva.com/7978/1489800-7978166.pdf?src-supplier=Element14; ComponentLink4Description: https://datasheet.ciiva.com/7978/1489800-7978166.pdf?src-supplier=Element14; ComponentLink5URL: https://datasheet.ciiva.com/31394/1489800-31394927.pdf?src-supplier=Farnell; ComponentLink5Description: https://datasheet.ciiva.com/31394/1489800-31394927.pdf?src-supplier=Farnell; ComponentLink6URL: https://datasheet.ciiva.com/22749/1489800-22749214.pdf?src-supplier=Element14; ComponentLink6Description: https://datasheet.ciiva.com/22749/1489800-22749214.pdf?src-supplier=Element14; ComponentLink7URL: https://datasheet.ciiva.com/144/mlccorderingcode-144177.pdf?src-supplier=Digi-Key; ComponentLink7Description: https://datasheet.ciiva.com/144/mlccorderingcode-144177.pdf?src-supplier=Digi-Key; ComponentLink8URL: https://datasheet.ciiva.com/144/mlccorderingcode-144176.pdf?src-supplier=Digi-Key; ComponentLink8Description: https://datasheet.ciiva.com/144/mlccorderingcode-144176.pdf?src-supplier=Digi-Key; ComponentLink9URL: https://datasheet.ciiva.com/144/mlccorderingcode-144178.pdf?src-supplier=Digi-Key; ComponentLink9Description: https://datasheet.ciiva.com/144/mlccorderingcode-144178.pdf?src-supplier=Digi-Key
C12 C13 = CL10A105KB8NNNC: CAP CER 1UF 50V X5R 0603; Manufacturer: Samsung; Tolerance: 10%; Supplier: Digi-Key; Supplier Part Number: 1276-1860-1-ND; Manufacturer Part Number: CL10A105KB8NNNC; RoHS: Yes; Category: Ceramic Capacitors; Stock: 3695273; Pricing: 1=0.14, 10=0.098, 50=0.0558, 100=0.0462, 500=0.03238, 1000=0.0268 (USD); Mounting Technology: Surface Mount; Case/Package: 0603; Case Code (Metric): 1608; Case Code (Imperial): 0603; Min Operating Temperature: -55°C; Max Operating Temperature: 85°C; Packaging: Tape and Reel; Value: 1uF; Voltage Rating: 50V; Dielectric: X5R; Series: CL; Length: 1.6mm; Depth: 0.8mm; Radiation Hardening: No; RoHS Compliant: Yes; ComponentLink1URL: https://datasheet.ciiva.com/26877/getdatasheetpartid-753736-26877879.pdf?src-supplier=Verical; ComponentLink1Description: https://datasheet.ciiva.com/26877/getdatasheetpartid-753736-26877879.pdf?src-supplier=Verical
C14 C15 = GRM21BZ71A226ME15L: CAP CER 22UF 10V X7R 0805; Manufacturer: Murata; Supplier: Digi-Key; Supplier Part Number: 490-GRM21BZ71A226ME15LCT-ND; Manufacturer Part Number: GRM21BZ71A226ME15L; RoHS: Yes; Category: Ceramic Capacitors; Stock: 55376; Pricing: 1=0.35, 10=0.241, 50=0.1688, 100=0.1447, 500=0.10852, 1000=0.09164 (USD); RoHS Compliant: Yes; ComponentLink1URL: https://datasheet.octopart.com/GRM21BZ71A226ME15L-Murata-datasheet-165579666.pdf?src-supplier=TME; ComponentLink1Description: https://datasheet.octopart.com/GRM21BZ71A226ME15L-Murata-datasheet-165579666.pdf?src-supplier=TME
D1 = SSB43L-E3/52T: DIODE SCHOTTKY 30V 4A DO214AA; Manufacturer: Vishay Semiconductors; Max Surge Current: 100A; Forward Voltage: 450mV; Max Reverse Current: 600uA; Polarity: Standard; Supplier: Digi-Key; Supplier Part Number: SSB43L-E3/52TGICT-ND; Manufacturer Part Number: SSB43L-E3/52T; RoHS: Yes; Category: Rectifier Diodes; Stock: 42896; Pricing: 1=0.56, 10=0.482, 100=0.3351 (USD); Mounting Technology: Surface Mount; Case/Package: DO-214AA; Pins: 2; Min Operating Temperature: -65°C; Max Operating Temperature: 150°C; Packaging: Tape and Reel; Forward Current: 4A; Package Quantity: 1; Max Reverse Leakage Current: 600uA; Average Rectified Current: 4A; Peak Non-Repetitive Surge Current: 100A; Max Repetitive Reverse Voltage (Vrrm): 30V; Max Forward Surge Current (Ifsm): 100A; Voltage Rating (DC): 30V; Current Rating: 4A; Output Current: 4A; Max Reverse Voltage (DC): 30V; Length: 4.7mm; Width: 3.8mm; Height: 0.095inch; Radiation Hardening: No; Lead Free: Lead Free; RoHS Compliant: Yes; Reach SVHC Compliant: Unknown; ComponentLink1URL: https://datasheet.ciiva.com/14634/0900766b80dd0508-14634162.pdf?src-supplier=Allied+Electronics; ComponentLink1Description: https://datasheet.ciiva.com/14634/0900766b80dd0508-14634162.pdf?src-supplier=Allied+Electronics; ComponentLink2URL: https://datasheet.ciiva.com/4245/ssb43l-4245635.pdf?src-supplier=Arrow+Electronics; ComponentLink2Description: https://datasheet.ciiva.com/4245/ssb43l-4245635.pdf?src-supplier=Arrow+Electronics; ComponentLink3URL: https://datasheet.ciiva.com/18434/70217334-18434422.pdf?src-supplier=Allied+Electronics; ComponentLink3Description: https://datasheet.ciiva.com/18434/70217334-18434422.pdf?src-supplier=Allied+Electronics
I2 I3 J5 J6 = CMP-15831-000009-1: as I1 on sheet VBAT to 12V; ComponentLink2URL: https://cdn.harwin.com/pdfs/M20-999.pdf; ComponentLink2Description: Datasheet; Package: M20-9990246; Temperature: -40°C to +105°C; Octopart: https://octopart.com/m20-9990246-harwin-2590635; Mouser Description: 2.54mm (0.1") Pitch SIL Vertical PC Tail Pin Header, 6.1mm mating pin height, tin, 2 contacts; Temperature Range High: +105°C; Device Class L1: Connectors; RoHS: TRUE; Automotive: No; Height: 8.99mm; Number Of Rows: 1; Contact Material: Tin,Nickel; Category: Conn; Pitch: 2.54mm; Lead Free: Yes; Digikey Description: CONN HEADER VERT 2POS 2.54MM; Manufacturer Part Number: M20-9990246; Temperature Range Low: -40°C; Device Class L3: unset; Device Class L2: Headers and Wire Housings
J3 = PREC002SAAN-RC: CONN HEADER VERT 2POS 2.54MM; Manufacturer: Sullins; Number of Positions: 2; Pitch: 0.1inch; Supplier: Digi-Key; Supplier Part Number: S1012EC-02-ND; Manufacturer Part Number: PREC002SAAN-RC; RoHS: Yes; Category: Connectors; Stock: 23153; Pricing: 1=0.06, 10=0.056, 25=0.0416, 50=0.0356, 100=0.0345, 250=0.02972, 500=0.02852 (USD); Mounting Technology: Through Hole; Color: Black; Contact Plating: Tin; Package Quantity: 1; Number of Rows: 1; Packaging: Bulk; Termination: Solder; Series: -; Contact Type: Male Pin; Contact Mating Length: 0.23inch; RoHS Compliant: Yes; ComponentLink1URL: https://datasheet.ciiva.com/740/zrzczzzszzn-rc-st-11635-b-740843.pdf?src-supplier=Digi-Key; ComponentLink1Description: https://datasheet.ciiva.com/740/zrzczzzszzn-rc-st-11635-b-740843.pdf?src-supplier=Digi-Key
J7 = SM02B-GHS-TB: CONN HDR PIN; Manufacturer: JST; Supplier: Digikey; Supplier Part Number: 455-1564-1-ND; Manufacturer Part Number: SM02B-GHS-TB; RoHS: No; Stock: 9689; Pricing: 1=0.46, 10=0.39, 100=0.303, 500=0.2597, 1000=0.21642 (USD)
J8 = PPTC041LFBN-RC: CONN HDR 4POS 0.1 TIN PCB; Manufacturer: Sullins; Number of Positions: 4; Connector Type: Header; Voltage Rating: 250V; Pitch: 2.54mm; Supplier: Digikey; Supplier Part Number: S7002-ND; Manufacturer Part Number: PPTC041LFBN-RC; RoHS: Yes; Category: Connectors; Stock: 28323; Pricing: 1=0.46, 10=0.399, 100=0.3286, 500=0.28574, 1000=0.23574, 5000=0.20716, 10000=0.2041 (USD); Mounting Technology: Through Hole; Contact Material: Bronze; Housing Material: Plastic; Contact Finish - Mating: TIN; Insulation Color: Black; Insulation Material: Polyester; Contact Shape: Square; Min Operating Temperature: -40°C; Max Operating Temperature: 105°C; Number of Rows: 1; Packaging: Tray; Termination: Solder; Contact Type: Female Socket; Fastening Type: Pull; Series: -; Length: 10.7mm; Width: 2.5mm; Height: 8.5mm; Lead Free: Lead Free; RoHS Compliant: Yes; Flammability Rating: UL94 V-0; ComponentLink1URL: https://media.digikey.com/pdf/Data%20Sheets/Sullins%20PDFs/Female_Headers.100_DS.pdf?src-supplier=Digikey; ComponentLink1Description: https://media.digikey.com/pdf/Data%20Sheets/Sullins%20PDFs/Female_Headers.100_DS.pdf?src-supplier=Digikey; ComponentLink2URL: http://www.sullinscorp.com/catalogs/78_Page80-81_HEADER_.100_2.54mm_FEMALE.pdf?src-supplier=Future+Electronics; ComponentLink2Description: http://www.sullinscorp.com/catalogs/78_Page80-81_HEADER_.100_2.54mm_FEMALE.pdf?src-supplier=Future+Electronics; ComponentLink3URL: https://datasheet.octopart.com/PPTC041LFBN-RC-Sullins-datasheet-41308905.pdf?src-supplier=Future+Electronics; ComponentLink3Description: https://datasheet.octopart.com/PPTC041LFBN-RC-Sullins-datasheet-41308905.pdf?src-supplier=Future+Electronics
L2 = CLF10060NIT-6R8N-D: FIXED IND 6.8UH 4.25A 16.9 MOHM; Manufacturer: TDK; Core Material: Ferrite; RMS Current (Irms): 6.6A; DC Resistance (DCR): 16.9mR; Inductance Tolerance: 30%; Shielding: Shielded; Test Frequency: 100kHz; Supplier: Digi-Key; Supplier Part Number: 445-174715-1-ND; Manufacturer Part Number: CLF10060NIT-6R8N-D; RoHS: Yes; Category: Fixed Inductors; Stock: 2437; Pricing: 1=1.43, 10=1.323, 25=1.1024, 50=1.0364, 100=0.9261, 250=0.7938 (USD); Mounting Technology: Surface Mount; Case/Package: Nonstandard; Min Operating Temperature: -55°C; Max Operating Temperature: 150°C; Value: 6.8uH; Saturation Current: 4.25A; Packaging: Tape and Reel; Series: CLF-NI-D; Tolerance: 30%; Ratings: AEC-Q200; Reach SVHC Compliant: No; RoHS Compliant: Yes; ComponentLink1URL: https://product.tdk.com/info/en/catalog/datasheets/inductor_automotive_power_clf10060ni-d_en.pdf?src-supplier=Digi-Key; ComponentLink1Description: https://product.tdk.com/info/en/catalog/datasheets/inductor_automotive_power_clf10060ni-d_en.pdf?src-supplier=Digi-Key; ComponentLink2URL: https://product.tdk.com/info/en/catalog/datasheets/inductor_automotive_power_clf10060ni-d_en.pdf?ref_disty=digikey&src-supplier=Digi-Key; ComponentLink2Description: https://product.tdk.com/info/en/catalog/datasheets/inductor_automotive_power_clf10060ni-d_en.pdf?ref_disty=digikey&src-supplier=Digi-Key; ComponentLink3URL: http://www.farnell.com/datasheets/2159117.pdf?src-supplier=Element14; ComponentLink3Description: http://www.farnell.com/datasheets/2159117.pdf?src-supplier=Element14
R8 R9 R11-R13 = RC0603FR-1310KL: RES 10K OHM 1% 1/10W 0603; Manufacturer: Yageo; Value: 10kR; Power Rating: 100mW; Voltage Rating: 50V; Temperature Coefficient: 100ppm/°C; Supplier: Digi-Key; Supplier Part Number: 13-RC0603FR-1310KLDKR-ND; Manufacturer Part Number: RC0603FR-1310KL; RoHS: Yes; Category: Chip SMD Resistors; Stock: 124542; Pricing: 1=0.1, 10=0.018, 50=0.0106, 100=0.0088, 500=0.00592, 1000=0.00505, 5000=0.00363, 10000=0.00318 (USD); Pins: 2; Case Code (Imperial): 0603; Case Code (Metric): 1608; Case/Package: 0603; Min Operating Temperature: -55°C; Max Operating Temperature: 155°C; Tolerance: 1%; Packaging: Tape and Reel; Resistor Type: Thick Film; Termination: SMD/SMT; Voltage Rating (DC): 50V; Series: RC; Resistance Tolerance: 1%; RoHS Compliant: Yes; Reach SVHC Compliant: No; Lead Free: Lead Free; ComponentLink1URL: https://datasheet.ciiva.com/7983/443971-7983673.pdf?src-supplier=Element14; ComponentLink1Description: https://datasheet.ciiva.com/7983/443971-7983673.pdf?src-supplier=Element14; ComponentLink2URL: https://datasheet.ciiva.com/16850/pyu-rc0603-51-rohs-l-4-16850349.pdf?src-supplier=Future+Electronics; ComponentLink2Description: https://datasheet.ciiva.com/16850/pyu-rc0603-51-rohs-l-4-16850349.pdf?src-supplier=Future+Electronics
R10 = CMP-00078-2: Footprint for allowing switching of signal lines
TP4-TP7 = Test_point1
U2 = CMP-357-000000-6: STM32F446ZE, mbed-Enabled Development Nucleo-144 STM32F4 ARMÂ® CortexÂ®-M4 MCU 32-Bit Embedded Evaluation Board; MF: STMicroelectronics; Design Item ID: NUCLEO-F446ZE; Availability: In Stock; SnapEDA_Link: https://www.snapeda.com/parts/NUCLEO-F446ZE/STMicroelectronics/view-part/?ref=snap; MP: NUCLEO-F446ZE; Pin Count: 244; Component Type: Standard; Package: None; Source: NUCLEO-F446ZE.SchLib; Purchase-URL: https://pricing.snapeda.com/search/part/NUCLEO-F446ZE/?ref=eda; Price: None; Value: *; Check_prices: https://www.snapeda.com/parts/NUCLEO-F446ZE/STMicroelectronics/view-part/?ref=eda
U3 = ADP2303ARDZ-5.0-R7: IC REG BUCK 5V 3A 8SOIC; Manufacturer: Analog Devices; Number of Outputs: 1; Min Input Voltage: 3V; Max Supply Voltage: 20V; Rise Time: 170ns; Switching Frequency: 700kHz; Min Output Voltage: 800mV; Synchronous Rectifier: No; Operating Supply Current: 950uA; Fall Time: 280ns; Max Duty Cycle: 50%; Max Output Voltage: 16V; Output Type: Fixed; Output Configuration: Positive; Supplier: Digi-Key; Supplier Part Number: 505-ADP2303ARDZ-5.0-R7CT-ND; Manufacturer Part Number: ADP2303ARDZ-5.0-R7; RoHS: Yes; Category: Voltage Regulators - Switching; Stock: 1579; Pricing: 1=4.1, 10=3.678, 25=3.4768, 100=3.0133, 250=2.8588, 500=2.5652 (USD); Mounting Technology: Surface Mount; Case/Package: SOIC; Pins: 8; Weight: 0.019048oz; Contact Plating: Tin,Matte; Min Operating Temperature: -40°C; Max Operating Temperature: 125°C; Packaging: Tape and Reel; Output Current: 3A; Output Voltage: 5V; Operating Supply Voltage: 20V; Nominal Output Voltage: 5V; Max Output current: 3A; Series: -; Length: 4.9mm; Width: 4mm; Height: 1.75mm; Radiation Hardening: No; Reach SVHC Compliant: No; Lead Free: Contains Lead; RoHS Compliant: Yes; ComponentLink1URL: https://datasheet.ciiva.com/25626/0900766b810b59f9-25626508.pdf?src-supplier=Rs; ComponentLink1Description: https://datasheet.ciiva.com/25626/0900766b810b59f9-25626508.pdf?src-supplier=Rs; ComponentLink2URL: https://datasheet.ciiva.com/7994/1624274-7994911.pdf?src-supplier=Element14; ComponentLink2Description: https://datasheet.ciiva.com/7994/1624274-7994911.pdf?src-supplier=Element14; ComponentLink3URL: https://datasheet.ciiva.com/28436/1624274-28436554.pdf?src-supplier=Element14; ComponentLink3Description: https://datasheet.ciiva.com/28436/1624274-28436554.pdf?src-supplier=Element14; ComponentLink4URL: https://datasheet.ciiva.com/2024/adp2302-2303-2024382.pdf?src-supplier=Digi-Key; ComponentLink4Description: https://datasheet.ciiva.com/2024/adp2302-2303-2024382.pdf?src-supplier=Digi-Key; ComponentLink5URL: https://datasheet.ciiva.com/2024/adp2302-2303-2024383.pdf?src-supplier=Digi-Key; ComponentLink5Description: https://datasheet.ciiva.com/2024/adp2302-2303-2024383.pdf?src-supplier=Digi-Key; ComponentLink6URL: https://datasheet.ciiva.com/2024/adp2302-2303-2024384.pdf?src-supplier=Digi-Key; ComponentLink6Description: https://datasheet.ciiva.com/2024/adp2302-2303-2024384.pdf?src-supplier=Digi-Key; ComponentLink7URL: https://datasheet.ciiva.com/48696/001251161-da-01-en-ic-reg-buc-adp2303ardz-5-0-r7-soic-8-adi-48696838.pdf?src-supplier=Conrad; ComponentLink7Description: https://datasheet.ciiva.com/48696/001251161-da-01-en-ic-reg-buc-adp2303ardz-5-0-r7-soic-8-adi-48696838.pdf?src-supplier=Conrad
U4 = NCP186AMX330TAG: ICREGLDO3.3V1A8XDFN
U5 = EV3419A: MC3419 DAUGHTER CARD; Manufacturer: Memsic; Supplier: Digi-Key; Supplier Part Number: 3502-EV3419A-ND; Manufacturer Part Number: EV3419A; RoHS: No; Category: Uncategorized; Stock: 42; Pricing: 1=14.51 (USD)
U6 = MIKROE-3449: Gyro 3 Click I3G4250 Three-Axis Digital Gyroscope Sensor IC Add-On Board; Manufacturer: mikroElektronika; Supplier: Digi-Key; Supplier Part Number: 1471-2189-ND; Manufacturer Part Number: MIKROE-3449; RoHS: No; Stock: 1; Pricing: 1=25 (USD)

## Sheet Current Sensing.SchDoc
size A4; SheetNumber: 4; SheetTotal: 4
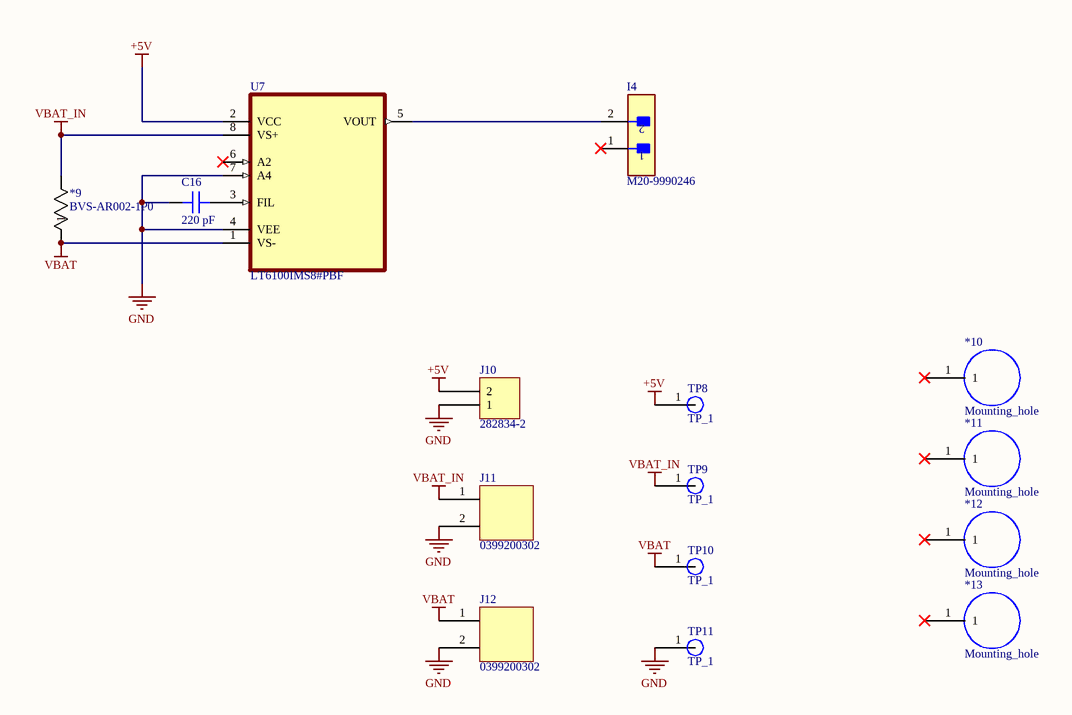
[diagram p3: Current Sensing.SchDoc]

### Parts
*9  BVS-AR002-1P0  [BVS-R002-1P0]
*10  Mounting_hole  [Mounting_Hole]
*11  Mounting_hole  [Mounting_Hole]
*12  Mounting_hole  [Mounting_Hole]
*13  Mounting_hole  [Mounting_Hole]
C16  220 pF  [CAP 0402_1005]
I4  M20-9990246  [FP-M20-9990246-MFG]
J10  282834-2  [TE 282834-2]
J11  0399200302  [0399200302]  (no BOM)
J12  0399200302  [0399200302]  (no BOM)
TP8  TP_1  [Test_point1]  (no BOM)
TP9  TP_1  [Test_point1]  (no BOM)
TP10  TP_1  [Test_point1]  (no BOM)
TP11  TP_1  [Test_point1]  (no BOM)
U7  LT6100IMS8#PBF  [SOP65P490X110-8N]

### Nets
+5V: J10.2 TP8.1 U7.2(VCC)
GND: C16.1 J10.1 J11.2 J12.2 TP11.1 U7.4(VEE) U7.7(A4)
VBAT: *9.1 J12.1 TP10.1 U7.1(VS-)
VBAT_IN: *9.2 J11.1 TP9.1 U7.8(VS+)
NetC16_2: C16.2 U7.3(FIL)
NetI4_2: I4.2 U7.5(VOUT)

Not connected (* = marked no-connect by the designer): *10 1*; *11 1*; *12 1*; *13 1*; I4 1*; U7 6(A2)*

### Library data of the parts
C16 = UMK105CH221JVHF: CAP CER 220PF 50V CH 0402; manufacturer: Taiyo Yuden; Tolerance: ±5%; Part Number: UMK105CH221JVHF; Value: 220 pF; Applications: Automotive; Capacitance: 220 pF; componentlink2description: DigiKey Link; componentlink2url: https://www.digikey.com/en/products/detail/taiyo-yuden/UMK105CH221JVHF/6563668; Device Package: 0402 (1005 Metric); lastupdated: 2024-01-28 8:04:19 PM; Lifecycle Status: Active; Minimum Order: 1; Mounting Type: Surface Mount, MLCC; Package / Case: 0402 (1005 Metric); packaging: TapeAndReel; partid: 1938; Part Status: Active; price: 0.01; Ratings: AEC-Q200; series: M; Size / Dimension: 0.039" L x 0.020" W (1.00mm x 0.50mm); Supplier 1: DigiKey; Supplier Part Number 1: 587-5075-1-ND; Temperature Coefficient: CH; Voltage - Rated: 50V
I4 = CMP-15831-000009-1: as I1 on sheet VBAT to 12V; ComponentLink2URL: https://cdn.harwin.com/pdfs/M20-999.pdf; ComponentLink2Description: Datasheet; Package: M20-9990246; Temperature: -40°C to +105°C; Octopart: https://octopart.com/m20-9990246-harwin-2590635; Mouser Description: 2.54mm (0.1") Pitch SIL Vertical PC Tail Pin Header, 6.1mm mating pin height, tin, 2 contacts; Temperature Range High: +105°C; Device Class L1: Connectors; RoHS: TRUE; Automotive: No; Height: 8.99mm; Number Of Rows: 1; Contact Material: Tin,Nickel; Category: Conn; Pitch: 2.54mm; Lead Free: Yes; Digikey Description: CONN HEADER VERT 2POS 2.54MM; Manufacturer Part Number: M20-9990246; Temperature Range Low: -40°C; Device Class L3: unset; Device Class L2: Headers and Wire Housings
J10 = 282834-2: TERM BLK 2P SIDE ENT 2.54MM PCB; Manufacturer: TE Connectivity AMP Connectors; Current: 10A; Mating Orientation: Horizontal with Board; Number of Levels: 1; Pitch: 0.100" (2.54mm); Positions Per Level: 2; Voltage: 150V; Wire Gauge: 16-30 AWG; Wire Termination: Screw - Rising Cage Clamp; Part Number: 282834-2; Color: Green; ComponentLink1Description: Datasheet; ComponentLink1URL: https://www.te.com/commerce/DocumentDelivery/DDEController?Action=srchrtrv&DocNm=282834&DocType=Customer+Drawing&DocLang=English; ComponentLink2Description: DigiKey Link; ComponentLink2URL: http://digikey.com/product-detail/en/te-connectivity-amp-connectors/282834-2/A98333-ND/1150135; LastUpdated: 2020-01-15 4:15:38 AM; Lifecycle Status: Active; Minimum Order: 1; Mounting Type: Through Hole; Packaging: Bulk; Part Status: Active; Price: 0.88; Series: Buchanan; Supplier 1: DigiKey; Supplier Part Number 1: A98333-ND
TP8-TP11 = Test_point1
U7 = CMP-353-000000-2: Precision, Gain Selectable High Side Current Sense Amplifier; MF: Analog Devices; Design Item ID: LT6100IMS8#PBF; Component Type: Standard; Value: *; Check_prices: https://www.snapeda.com/parts/LT6100IMS8%23PBF/Analog+Devices/view-part/?ref=eda; SnapEDA_Link: https://www.snapeda.com/parts/LT6100IMS8%23PBF/Analog+Devices/view-part/?ref=snap; Pin Count: 8; Package: MSOP-8 Analog Devices; MP: LT6100IMS8#PBF; Source: LT6100IMS8#PBF.SchLib

## Nets that join several sheets
+5V: Microcontroller (12 pins), Current Sensing (J10.2 TP8.1 U7.2)
GND: VBAT to 12V (17 pins), Microcontroller (32 pins), Current Sensing (7 pins)
VBAT: VBAT to 12V (7 pins), Microcontroller (7 pins), Current Sensing (*9.1 J12.1 TP10.1 U7.1)